# Altium schematic sheet USB.SchDoc
size A4
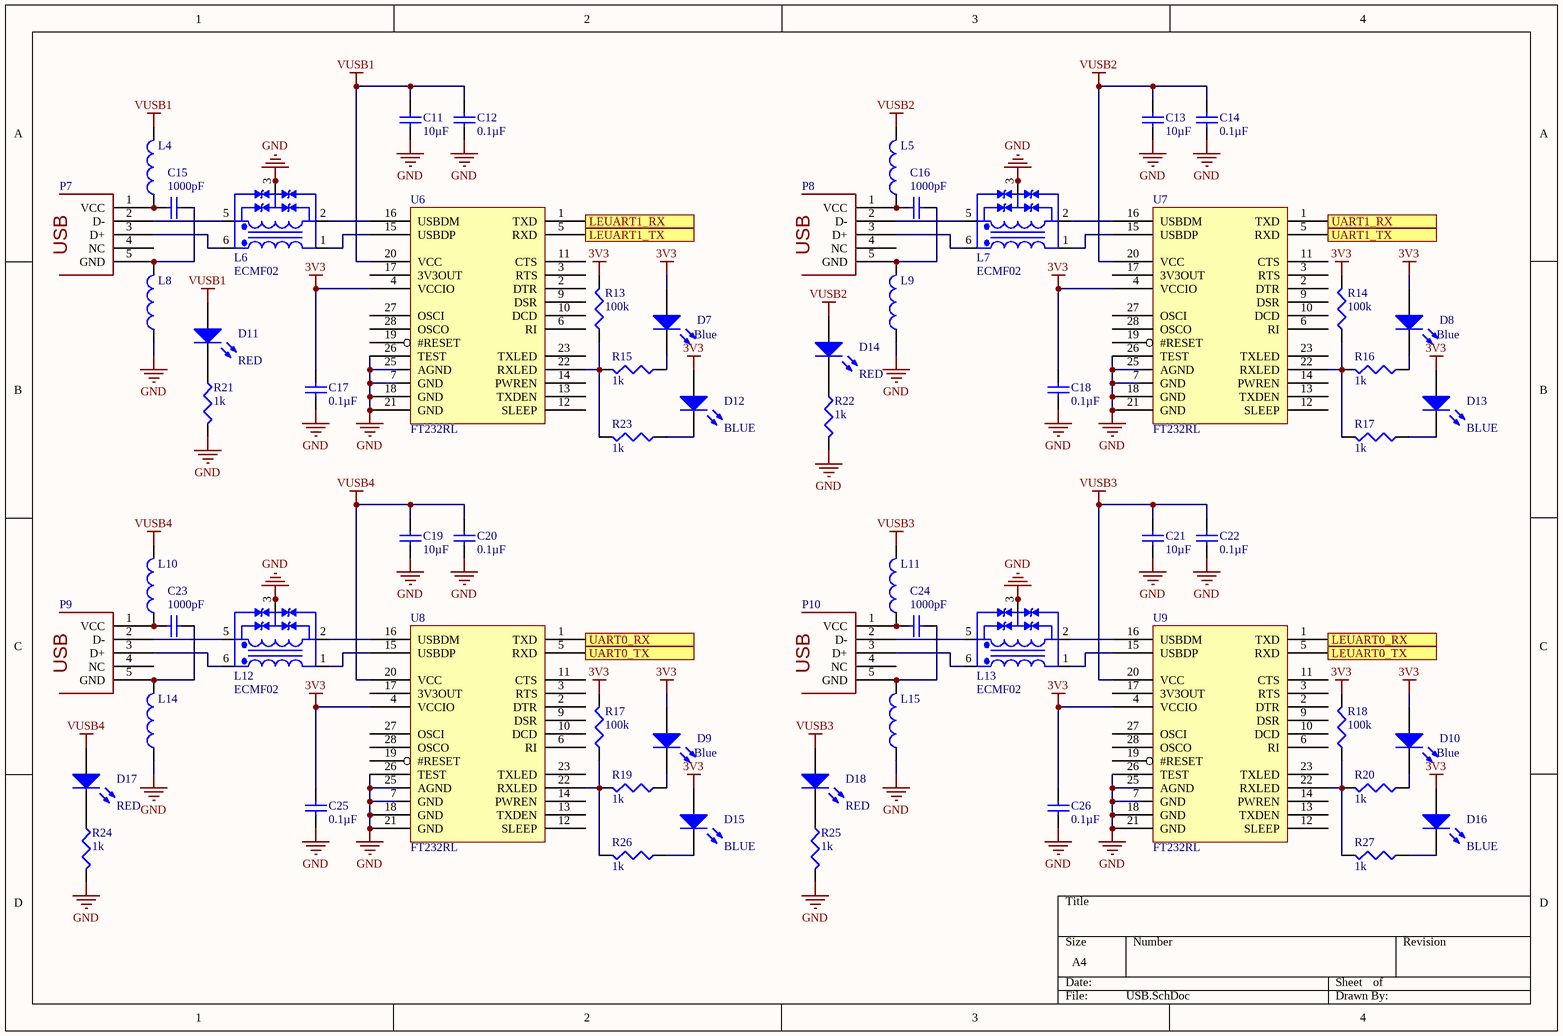
[diagram p0: USB.SchDoc]

## Parts
(Parts that share a designator on the sheet are numbered #1, #2 ... from top to bottom, then left to right.)
C11  value 10µF  [TDK-CGA5L]  (hidden comment: Cap)
C12  value 0.1µF  [TDK-CGA3E]  (hidden comment: Cap)
C13  value 10µF  [TDK-CGA5L]  (hidden comment: Cap)
C14  value 0.1µF  [TDK-CGA3E]  (hidden comment: Cap)
C15  value 1000pF  [TDK-CGA3E]  (hidden comment: Cap)
C16  value 1000pF  [TDK-CGA3E]  (hidden comment: Cap)
C17  value 0.1µF  [TDK-CGA3E]  (hidden comment: Cap)
C18  value 0.1µF  [TDK-CGA3E]  (hidden comment: Cap)
C19  value 10µF  [TDK-CGA5L]  (hidden comment: Cap)
C20  value 0.1µF  [TDK-CGA3E]  (hidden comment: Cap)
C21  value 10µF  [TDK-CGA5L]  (hidden comment: Cap)
C22  value 0.1µF  [TDK-CGA3E]  (hidden comment: Cap)
C23  value 1000pF  [TDK-CGA3E]  (hidden comment: Cap)
C24  value 1000pF  [TDK-CGA3E]  (hidden comment: Cap)
C25  value 0.1µF  [TDK-CGA3E]  (hidden comment: Cap)
C26  value 0.1µF  [TDK-CGA3E]  (hidden comment: Cap)
D7  value Blue  [WL-151034XS03000]  (hidden comment: LED)
D8  value Blue  [WL-151034XS03000]  (hidden comment: LED)
D9  value Blue  [WL-151034XS03000]  (hidden comment: LED)
D10  value Blue  [WL-151034XS03000]  (hidden comment: LED)
D11  value RED  [WL-150060XS75000]  (hidden comment: LED)
D12  value BLUE  [WL-150060XS75000]  (hidden comment: LED)
D13  value BLUE  [WL-150060XS75000]  (hidden comment: LED)
D14  value RED  [WL-150060XS75000]  (hidden comment: LED)
D15  value BLUE  [WL-150060XS75000]  (hidden comment: LED)
D16  value BLUE  [WL-150060XS75000]  (hidden comment: LED)
D17  value RED  [WL-150060XS75000]  (hidden comment: LED)
D18  value RED  [WL-150060XS75000]  (hidden comment: LED)
L4  Inductor  [TDK-MPX1608]  (value not drawn)
L5  Inductor  [TDK-MPX1608]  (value not drawn)
L6  ECMF02  [STM-QFN6L]
L7  ECMF02  [STM-QFN6L]
L8  Inductor  [TDK-MPX1608]  (value not drawn)
L9  Inductor  [TDK-MPX1608]  (value not drawn)
L10  Inductor  [TDK-MPX1608]  (value not drawn)
L11  Inductor  [TDK-MPX1608]  (value not drawn)
L12  ECMF02  [STM-QFN6L]
L13  ECMF02  [STM-QFN6L]
L14  Inductor  [TDK-MPX1608]  (value not drawn)
L15  Inductor  [TDK-MPX1608]  (value not drawn)
P7  USB  [WL-651005136521]  (value not drawn)
P8  USB  [WL-651005136521]  (value not drawn)
P9  USB  [WL-651005136521]  (value not drawn)
P10  USB  [WL-651005136521]  (value not drawn)
R13  value 100k  [PANA-ERJ3EK]  (hidden comment: Res3)
R14  value 100k  [PANA-ERJ3EK]  (hidden comment: Res3)
R15  value 1k  [PANA-ERJ3EK]  (hidden comment: Res3)
R16  value 1k  [PANA-ERJ3EK]  (hidden comment: Res3)
R17#1  value 1k  [PANA-ERJ3EK]  (hidden comment: Res3)
R17#2  value 100k  [PANA-ERJ3EK]  (hidden comment: Res3)
R18  value 100k  [PANA-ERJ3EK]  (hidden comment: Res3)
R19  value 1k  [PANA-ERJ3EK]  (hidden comment: Res3)
R20  value 1k  [PANA-ERJ3EK]  (hidden comment: Res3)
R21  value 1k  [PANA-ERJ3EK]  (hidden comment: Res3)
R22  value 1k  [PANA-ERJ3EK]  (hidden comment: Res3)
R23  value 1k  [PANA-ERJ3EK]  (hidden comment: Res3)
R24  value 1k  [PANA-ERJ3EK]  (hidden comment: Res3)
R25  value 1k  [PANA-ERJ3EK]  (hidden comment: Res3)
R26  value 1k  [PANA-ERJ3EK]  (hidden comment: Res3)
R27  value 1k  [PANA-ERJ3EK]  (hidden comment: Res3)
U6  FT232RL  [FT-SSOP28]
U7  FT232RL  [FT-SSOP28]
U8  FT232RL  [FT-SSOP28]
U9  FT232RL  [FT-SSOP28]

## Ports
LEUART0_RX, LEUART0_TX, LEUART1_RX, LEUART1_TX, UART0_RX, UART0_TX, UART1_RX, UART1_TX

## Nets
3V3: C17.2 C18.2 C25.2 C26.2 D7.1(A) D8.1(A) D9.1(A) D10.1(A) D12.1(A) D13.1(A) D15.1(A) D16.1(A) R13.2 R14.2 R17#2.2 R18.2 U6.4(VCCIO) U7.4(VCCIO) U8.4(VCCIO) U9.4(VCCIO)
GND: C11.1 C12.1 C13.1 C14.1 C17.1 C18.1 C19.1 C20.1 C21.1 C22.1 C25.1 C26.1 L6.3(GND) L6.4(NC) L7.3(GND) L7.4(NC) L8.1 L9.1 L12.3(GND) L12.4(NC) L13.3(GND) L13.4(NC) L14.1 L15.1 R21.2 R22.2 R24.2 R25.2 U6.7(GND) U6.8(NC) U6.18(GND) U6.21(GND) U6.24(NC) U6.25(AGND) U6.26(TEST) U7.7(GND) U7.8(NC) U7.18(GND) U7.21(GND) U7.24(NC) U7.25(AGND) U7.26(TEST) U8.7(GND) U8.8(NC) U8.18(GND) U8.21(GND) U8.24(NC) U8.25(AGND) U8.26(TEST) U9.7(GND) U9.8(NC) U9.18(GND) U9.21(GND) U9.24(NC) U9.25(AGND) U9.26(TEST)
VUSB1: C11.2 C12.2 D11.1(A) L4.2 U6.20(VCC)
VUSB2: C13.2 C14.2 D14.1(A) L5.2 U7.20(VCC)
VUSB3: C21.2 C22.2 D18.1(A) L11.2 U9.20(VCC)
VUSB4: C19.2 C20.2 D17.1(A) L10.2 U8.20(VCC)
LEUART0_RX: U9.1(TXD) ; port LEUART0_RX
LEUART0_TX: U9.5(RXD) ; port LEUART0_TX
LEUART1_RX: U6.1(TXD) ; port LEUART1_RX
LEUART1_TX: U6.5(RXD) ; port LEUART1_TX
UART0_RX: U8.1(TXD) ; port UART0_RX
UART0_TX: U8.5(RXD) ; port UART0_TX
UART1_RX: U7.1(TXD) ; port UART1_RX
UART1_TX: U7.5(RXD) ; port UART1_TX
NetC15_1: C15.1 L4.1 P7.1(VCC)
NetC15_2: C15.2 L8.2 P7.5(GND)
NetC16_1: C16.1 L5.1 P8.1(VCC)
NetC16_2: C16.2 L9.2 P8.5(GND)
NetC23_1: C23.1 L10.1 P9.1(VCC)
NetC23_2: C23.2 L14.2 P9.5(GND)
NetC24_1: C24.1 L11.1 P10.1(VCC)
NetC24_2: C24.2 L15.2 P10.5(GND)
NetD7_2: D7.2(K) R15.1
NetD8_2: D8.2(K) R16.1
NetD9_2: D9.2(K) R19.1
NetD10_2: D10.2(K) R20.1
NetD11_2: D11.2(K) R21.1
NetD12_2: D12.2(K) R23.1
NetD13_2: D13.2(K) R17#1.1
NetD14_2: D14.2(K) R22.1
NetD15_2: D15.2(K) R26.1
NetD16_2: D16.2(K) R27.1
NetD17_2: D17.2(K) R24.1
NetD18_2: D18.2(K) R25.1
NetL6_1: L6.1(DD+) U6.15(USBDP)
NetL6_2: L6.2(DD-) U6.16(USBDM)
NetL6_5: L6.5(UD-) P7.2(D-)
NetL6_6: L6.6(UD+) P7.3(D+)
NetL7_1: L7.1(DD+) U7.15(USBDP)
NetL7_2: L7.2(DD-) U7.16(USBDM)
NetL7_5: L7.5(UD-) P8.2(D-)
NetL7_6: L7.6(UD+) P8.3(D+)
NetL12_1: L12.1(DD+) U8.15(USBDP)
NetL12_2: L12.2(DD-) U8.16(USBDM)
NetL12_5: L12.5(UD-) P9.2(D-)
NetL12_6: L12.6(UD+) P9.3(D+)
NetL13_1: L13.1(DD+) U9.15(USBDP)
NetL13_2: L13.2(DD-) U9.16(USBDM)
NetL13_5: L13.5(UD-) P10.2(D-)
NetL13_6: L13.6(UD+) P10.3(D+)
NetR13_1: R13.1 R15.2 R23.2 U6.22(RXLED)
NetR14_1: R14.1 R16.2 R17#1.2 U7.22(RXLED)
NetR17#2_1: R17#2.1 R19.2 R26.2 U8.22(RXLED)
NetR18_1: R18.1 R20.2 R27.2 U9.22(RXLED)

Not connected (* = marked no-connect by the designer): P7 4(NC); P8 4(NC); P9 4(NC); P10 4(NC); U6 2(DTR) 3(RTS) 6(RI) 9(DSR) 10(DCD) 11(CTS) 12(SLEEP) 13(TXDEN) 14(PWREN) 17(3V3OUT) 19(#RESET) 23(TXLED) 27(OSCI) 28(OSCO); U7 2(DTR) 3(RTS) 6(RI) 9(DSR) 10(DCD) 11(CTS) 12(SLEEP) 13(TXDEN) 14(PWREN) 17(3V3OUT) 19(#RESET) 23(TXLED) 27(OSCI) 28(OSCO); U8 2(DTR) 3(RTS) 6(RI) 9(DSR) 10(DCD) 11(CTS) 12(SLEEP) 13(TXDEN) 14(PWREN) 17(3V3OUT) 19(#RESET) 23(TXLED) 27(OSCI) 28(OSCO); U9 2(DTR) 3(RTS) 6(RI) 9(DSR) 10(DCD) 11(CTS) 12(SLEEP) 13(TXDEN) 14(PWREN) 17(3V3OUT) 19(#RESET) 23(TXLED) 27(OSCI) 28(OSCO)

## Library data of the parts
C11 C13 C19 C21 = PC-TDK-02917: CAP CER 10UF 25V X7R 1206; Manufacturer Part Number: CGA5L1X7R1E106K160AC; Index: 2917; Tolerance: ±10%; Published: 3/16/2016; LatestRevisionDate: 3/16/2016; LatestRevisionNote: ...; PackageReference: 1206 (3216 Metric); Publisher: AlbertaSat; PackageDescription: Radial Cap, Thru-Hole; 2 Leads; 0.3 in Pin Spacing; Part Number: PC-TDK-02917; Supplier Part Number 1: 445-6990-1-ND; Supplier 1: Digi-key; Supplier Link: http://www.digikey.ca/product-search/en?keywords=445-6990-1-ND; Voltage - Rated: 25V; Temperature Coefficient: X7R; Applications: Automotive
C12 C14 C17 C18 C20 C22 C25 C26 = PC-TDK-02272: CAP CER 0.1UF 50V X8R 0603; Manufacturer Part Number: CGA3E3X8R1H104K080AB; Index: 2272; Tolerance: ±10%; Published: 3/16/2016; LatestRevisionDate: 3/16/2016; LatestRevisionNote: ...; PackageReference: 0603 (1608 Metric); Publisher: AlbertaSat; PackageDescription: Radial Cap, Thru-Hole; 2 Leads; 0.3 in Pin Spacing; Part Number: PC-TDK-02272; Supplier Part Number 1: 445-12606-1-ND; Supplier 1: Digi-key; Supplier Link: http://www.digikey.ca/product-search/en?keywords=445-12606-1-ND; Voltage - Rated: 50V; Temperature Coefficient: X8R; Applications: Automotive
C15 C16 C23 C24 = PC-TDK-01474: CAP CER 1000PF 250V C0G 0603; Manufacturer Part Number: CGA3E3C0G2E102J080AA; Index: 1474; Designator: C?; Tolerance: ±5%; Temperature Coefficient: NP0; Published: 3/16/2016; LatestRevisionDate: 3/16/2016; LatestRevisionNote: ...; PackageReference: 0603 (1608 Metric); Publisher: AlbertaSat; PackageDescription: Radial Cap, Thru-Hole; 2 Leads; 0.3 in Pin Spacing; Part Number: PC-TDK-01474; Supplier Part Number 1: 445-15529-1-ND; Supplier 1: Digi-key; Supplier Link: http://www.digikey.ca/product-search/en?keywords=445-15529-1-ND; Voltage - Rated: 250V; Applications: Automotive
D7-D10 = 51: LED BLUE CLEAR ROUND T/H; Part Number: 51; Manufacturer Part Number: 151034BS03000; Designator: D?; Brightness: 2400mcd; Published: 8-Jun-2000; LatestRevisionDate: 08-Jul-2005; LatestRevisionNote: Mech Layer 1 removed.; PackageReference: Round with Domed Top, 3.00mm; Publisher: Altium Limited; PackageDescription: LED; 2 Leads; Supplier Part Number 1: 732-11401-ND; Supplier 1: Digi-Key; Supplier Part Number 2: 710-151034BS03000; Supplier 2: Mouser; Supplier Link: http://www.digikey.ca/product-search/en?keywords=732-11401-ND
D11 D14 D17 D18 = 3: LED RED CLEAR 0603 SMD; Part Number: 3; Manufacturer Part Number: 150060RS75000; Designator: D?; Brightness: 250mcd; Published: 8-Jun-2000; LatestRevisionDate: 08-Jul-2005; LatestRevisionNote: Mech Layer 1 removed.; PackageReference: WL-150060XS75000; Publisher: Altium Limited; PackageDescription: LED; 2 Leads; Supplier Part Number 1: 732-4978-1-ND; Supplier 1: Digi-Key; Supplier Link: http://www.digikey.ca/product-search/en?keywords=732-4978-1-ND
D12 D13 D15 D16 = 4: LED BLUE CLEAR 0603 SMD; Part Number: 4; Manufacturer Part Number: 150060BS75000; Designator: D?; Brightness: 145mcd; Published: 8-Jun-2000; LatestRevisionDate: 08-Jul-2005; LatestRevisionNote: Mech Layer 1 removed.; PackageReference: WL-150060XS75000; Publisher: Altium Limited; PackageDescription: LED; 2 Leads; Supplier Part Number 1: 732-4966-1-ND; Supplier 1: Digi-Key; Supplier Link: http://www.digikey.ca/product-search/en?keywords=732-4966-1-ND
L4 L5 L8-L11 L14 L15 = PL-TDK-02954: FERRITE BEAD 1 KOHM 0603 1LN; Manufacturer Part Number: MPZ1608S102ATD25; Code_IEC: 1608; Value: 1 kOhm @ 100MHz; Index: 2954; Designator: L?; Current - Rated: 800mA; Published: 7/8/2017; LatestRevisionDate: 7/8/2017; LatestRevisionNote: ...; PackageReference: 0603 (1608 Metric); Publisher: AlbertaSat; PackageDescription: Chip Inductor, 2-Leads, Body 1.60x0.80mm, IPC Low Density; Code_JEITA: 0603; Part Number: PL-TDK-02954; Supplier Part Number 1: 445-172890-1-ND; Supplier 1: Digi-key; Supplier Part Number 2: 810-MPZ1608S102ATD25; Supplier 2: Mouser; Supplier Link: #https://www.digikey.ca/product-detail/en/tdk-corporation/MPZ1608S102ATD25/445-172890-1-ND/5040521#; Applications: Automotive
L6 L7 L12 L13 = PL-STM-00007: CMC 200MA 2LN SMD ESD; Index: 7; Designator: L?; Part Number: PL-STM-00007; Manufacturer Part Number: ECMF02-2AMX6; Supplier Part Number 1: 497-10773-1-ND; Supplier 1: Digi-key; Supplier Part Number 2: 511-ECMF02-2AMX6; Supplier 2: Mouser; Publisher: AlbertaSat; Published: 10/24/2017; LatestRevisionDate: 10/24/2017; LatestRevisionNote: ...; PackageReference: QFN 6-lead; Supplier Link: https://www.digikey.ca/product-detail/en/stmicroelectronics/ECMF02-2AMX6/497-10773-1-ND/2440287
P7-P10 = 1: USB - mini B Receptacle Connector 5 Position Through Hole, Right Angle, Horizontal; Part Number: 1; Manufacturer Part Number: 651005136521; Supplier Part Number 1: 732-2736-5-ND; Supplier 1: Digi-Key; Supplier Link: #http://www.digikey.ca/product-detail/en/651005136521/732-2736-5-ND/2508505#; PackageReference: WL-651005136521
R13 R14 R17#2 R18 = 18744: RES SMD 100K OHM 1% 1/10W 0603; Part Number: 18744; Manufacturer Part Number: ERJ-3EKF1003V; Designator: R?; Power: 0.1W, 1/10W; Temperature Coefficient: ±100ppm/°C; Published: 8-Jun-2000; LatestRevisionDate: 29-May-2009; LatestRevisionNote: IPC-7351 Footprint Added.; PackageReference: 0603 (1608 Metric); Publisher: Altium Limited; PackageDescription: Chip Resistor, 2-Leads, Body 1.60x0.80mm, IPC Low Density; Supplier Part Number 1: P100KHCT-ND; Supplier 1: Digi-Key; Supplier Link: http://www.digikey.ca/product-search/en?keywords=P100KHCT-ND; Tolerance: ±1%
R15 R16 R17#1 R19-R27 = 15398: RES SMD 1K OHM 1% 1/10W 0603; Part Number: 15398; Manufacturer Part Number: ERJ-3EKF1001V; Power: 0.1W, 1/10W; Temperature Coefficient: ±100ppm/°C; Published: 8-Jun-2000; LatestRevisionDate: 29-May-2009; LatestRevisionNote: IPC-7351 Footprint Added.; PackageReference: 0603 (1608 Metric); Publisher: Altium Limited; PackageDescription: Chip Resistor, 2-Leads, Body 1.60x0.80mm, IPC Low Density; Supplier Part Number 1: P1.00KHCT-ND; Supplier 1: Digi-Key; Supplier Link: http://www.digikey.ca/product-search/en?keywords=P1.00KHCT-ND; Tolerance: ±1%
U6-U9 = PU-FT-00001: IC USB FS SERIAL UART 28-SSOP; Manufacturer Part Number: FT232RL-REEL; Index: 1; Part Number: PU-FT-00001; Supplier Part Number 1: 768-1007-1-ND; Supplier 1: Digi-key; Supplier Part Number 2: 895-FT232RL; Supplier 2: Mouser; Publisher: AlbertaSat; Published: 4/5/2017; LatestRevisionDate: 4/5/2017; LatestRevisionNote: ...; PackageReference: FT-SSOP28; Supplier Link: http://www.digikey.ca/product-search/en?keywords=768-1007-1-ND